# Altium schematic sheet MainSch.SchDoc
size A
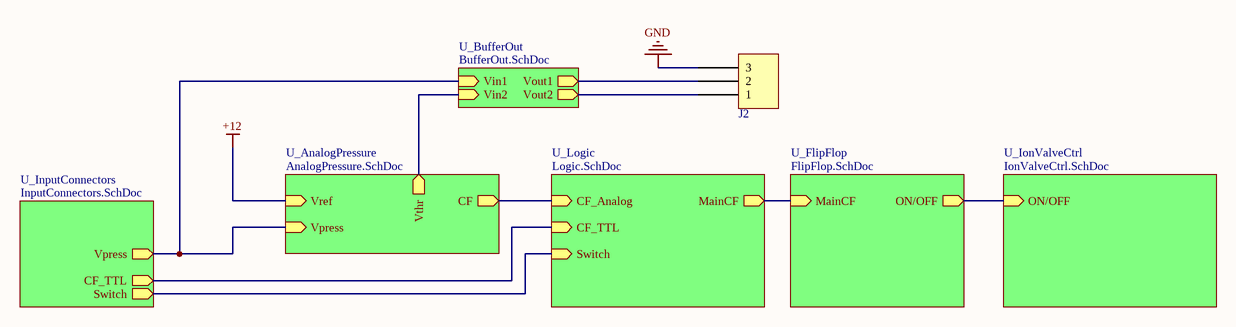
[diagram p0: MainSch.SchDoc]

## Parts
J2  0022272031  [MOLEX KK 0022272031]  (value not drawn)

## Sub-sheets
U_AnalogPressure = AnalogPressure.SchDoc: Vref (in), Vpress (in), CF (out), Vthr (out)
U_BufferOut = BufferOut.SchDoc: Vin1 (in), Vin2 (in), Vout1 (out), Vout2 (out)
U_FlipFlop = FlipFlop.SchDoc: MainCF (in), ON/OFF (out)
U_InputConnectors = InputConnectors.SchDoc: CF_TTL (out), Vpress (out), Switch (out)
U_IonValveCtrl = IonValveCtrl.SchDoc: ON/OFF (in)
U_Logic = Logic.SchDoc: CF_Analog (in), CF_TTL (in), Switch (in), MainCF (out)

## Nets
+12: sheet U_AnalogPressure/Vref
GND: J2.3
NetJ2_1: J2.1 ; sheet U_BufferOut/Vout2
NetJ2_2: J2.2 ; sheet U_BufferOut/Vout1
(unnamed): sheet U_AnalogPressure/Vpress, sheet U_InputConnectors/Vpress, sheet U_BufferOut/Vin1
(unnamed): sheet U_AnalogPressure/CF, sheet U_Logic/CF_Analog
(unnamed): sheet U_AnalogPressure/Vthr, sheet U_BufferOut/Vin2
(unnamed): sheet U_InputConnectors/CF_TTL, sheet U_Logic/CF_TTL
(unnamed): sheet U_InputConnectors/Switch, sheet U_Logic/Switch
(unnamed): sheet U_Logic/MainCF, sheet U_FlipFlop/MainCF
(unnamed): sheet U_FlipFlop/ON/OFF, sheet U_IonValveCtrl/ON/OFF

## Library data of the parts
J2 = 0022272031: CONN HEADER 3POS .100 VERT TIN; Manufacturer: Molex, LLC; Pitch: 0.100" (2.54mm); Number Of Positions: 3; Part Number: 0022272031; PartId: 9720; Supplier 1: Digi-Key; Supplier Part Number 1: WM4112-ND; ComponentLink1Description: Datasheet; ComponentLink1URL: http://www.molex.com/pdm_docs/sd/022272031_sd.pdf; ComponentLink2Description: Digi-Key Listing; ComponentLink2URL: http://www.digikey.com/product-search/en?keywords=22-27-2031; Price: 0.35; Type: Header, Unshrouded; Contact Finish: Tin; Fastening Type: Friction Lock; Number Of Rows: 1; Colour: Natural; Series: KK 6410